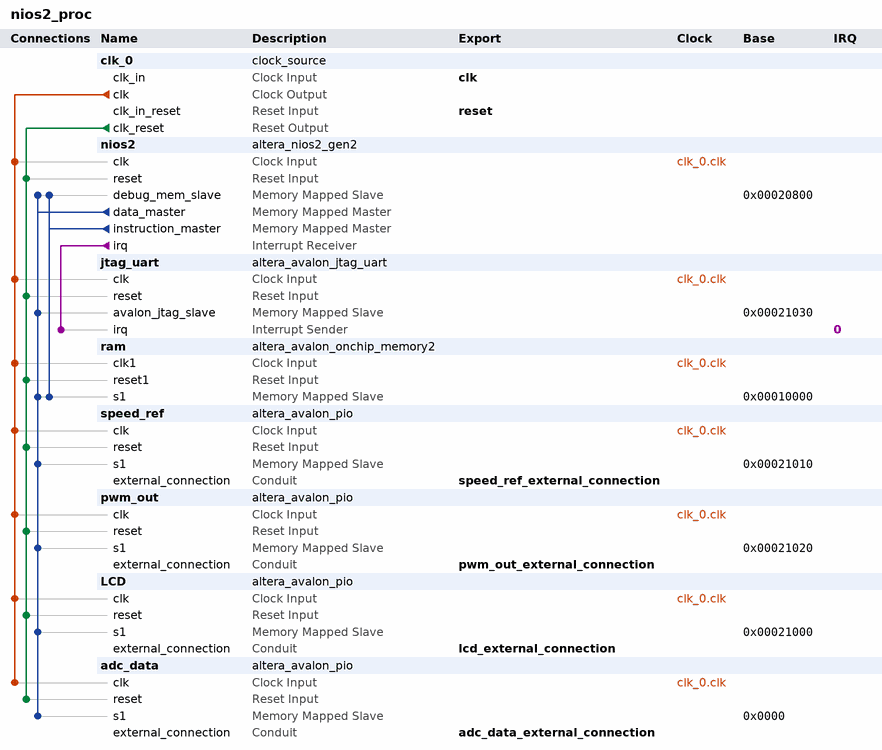
[diagram p0: system contents]
# Platform Designer (Qsys) system nios2_proc, Cyclone IV E EP4CE22F17C6
# Parameters at their usual value, and those the tool derives, are not listed.
package require -exact qsys 18.1
create_system nios2_proc
set_project_property DEVICE_FAMILY {Cyclone IV E}
set_project_property DEVICE EP4CE22F17C6

add_instance clk_0 clock_source 18.1
set_instance_parameter_value clk_0 clockFrequency 50000000

add_instance nios2 altera_nios2_gen2 18.1
set_instance_parameter_value nios2 dcache_size 2048
set_instance_parameter_value nios2 exceptionSlave ram.s1
set_instance_parameter_value nios2 icache_size 4096
set_instance_parameter_value nios2 impl Tiny
set_instance_parameter_value nios2 resetSlave ram.s1

add_instance jtag_uart altera_avalon_jtag_uart 18.1
set_instance_parameter_value jtag_uart simInteractiveOptions NO_INTERACTIVE_WINDOWS

add_instance ram altera_avalon_onchip_memory2 18.1
set_instance_parameter_value ram allowInSystemMemoryContentEditor true
set_instance_parameter_value ram dataWidth 32
set_instance_parameter_value ram dualPort false
set_instance_parameter_value ram initMemContent true
set_instance_parameter_value ram initializationFileName D:/project/bldc_controller/DE0_NANO/software/c_program/mem_init/nios2_proc_ram.hex
set_instance_parameter_value ram memorySize 41440
set_instance_parameter_value ram useNonDefaultInitFile true

add_instance speed_ref altera_avalon_pio 18.1
set_instance_parameter_value speed_ref direction Input
set_instance_parameter_value speed_ref width 10

add_instance pwm_out altera_avalon_pio 18.1
set_instance_parameter_value pwm_out direction Output
set_instance_parameter_value pwm_out width 8

add_instance LCD altera_avalon_pio 18.1
set_instance_parameter_value LCD direction Output
set_instance_parameter_value LCD width 11

add_instance adc_data altera_avalon_pio 18.1
set_instance_parameter_value adc_data direction Input
set_instance_parameter_value adc_data width 8

# connections
add_connection clk_0.clk adc_data.clk clock
add_connection clk_0.clk jtag_uart.clk clock
add_connection clk_0.clk LCD.clk clock
add_connection clk_0.clk nios2.clk clock
add_connection clk_0.clk pwm_out.clk clock
add_connection clk_0.clk ram.clk1 clock
add_connection clk_0.clk speed_ref.clk clock
add_connection clk_0.clk_reset adc_data.reset reset
add_connection clk_0.clk_reset jtag_uart.reset reset
add_connection clk_0.clk_reset LCD.reset reset
add_connection clk_0.clk_reset nios2.reset reset
add_connection clk_0.clk_reset pwm_out.reset reset
add_connection clk_0.clk_reset ram.reset1 reset
add_connection clk_0.clk_reset speed_ref.reset reset
add_connection nios2.data_master adc_data.s1 avalon
set_connection_parameter_value nios2.data_master/adc_data.s1 baseAddress 0x0000
add_connection nios2.data_master jtag_uart.avalon_jtag_slave avalon
set_connection_parameter_value nios2.data_master/jtag_uart.avalon_jtag_slave baseAddress 0x00021030
add_connection nios2.data_master LCD.s1 avalon
set_connection_parameter_value nios2.data_master/LCD.s1 baseAddress 0x00021000
add_connection nios2.data_master nios2.debug_mem_slave avalon
set_connection_parameter_value nios2.data_master/nios2.debug_mem_slave baseAddress 0x00020800
add_connection nios2.data_master pwm_out.s1 avalon
set_connection_parameter_value nios2.data_master/pwm_out.s1 baseAddress 0x00021020
add_connection nios2.data_master ram.s1 avalon
set_connection_parameter_value nios2.data_master/ram.s1 baseAddress 0x00010000
add_connection nios2.data_master speed_ref.s1 avalon
set_connection_parameter_value nios2.data_master/speed_ref.s1 baseAddress 0x00021010
add_connection nios2.instruction_master nios2.debug_mem_slave avalon
set_connection_parameter_value nios2.instruction_master/nios2.debug_mem_slave baseAddress 0x00020800
add_connection nios2.instruction_master ram.s1 avalon
set_connection_parameter_value nios2.instruction_master/ram.s1 baseAddress 0x00010000
add_connection nios2.irq jtag_uart.irq interrupt
set_connection_parameter_value nios2.irq/jtag_uart.irq irqNumber 0

# exported interfaces
add_interface adc_data_external_connection conduit end
set_interface_property adc_data_external_connection EXPORT_OF adc_data.external_connection
add_interface clk clock sink
set_interface_property clk EXPORT_OF clk_0.clk_in
add_interface lcd_external_connection conduit end
set_interface_property lcd_external_connection EXPORT_OF LCD.external_connection
add_interface pwm_out_external_connection conduit end
set_interface_property pwm_out_external_connection EXPORT_OF pwm_out.external_connection
add_interface reset reset sink
set_interface_property reset EXPORT_OF clk_0.clk_in_reset
add_interface speed_ref_external_connection conduit end
set_interface_property speed_ref_external_connection EXPORT_OF speed_ref.external_connection

set_interconnect_requirement {$system} qsys_mm.clockCrossingAdapter HANDSHAKE
set_interconnect_requirement {$system} qsys_mm.enableEccProtection FALSE
set_interconnect_requirement {$system} qsys_mm.insertDefaultSlave FALSE
set_interconnect_requirement {$system} qsys_mm.maxAdditionalLatency 1

save_system nios2_proc.qsys
